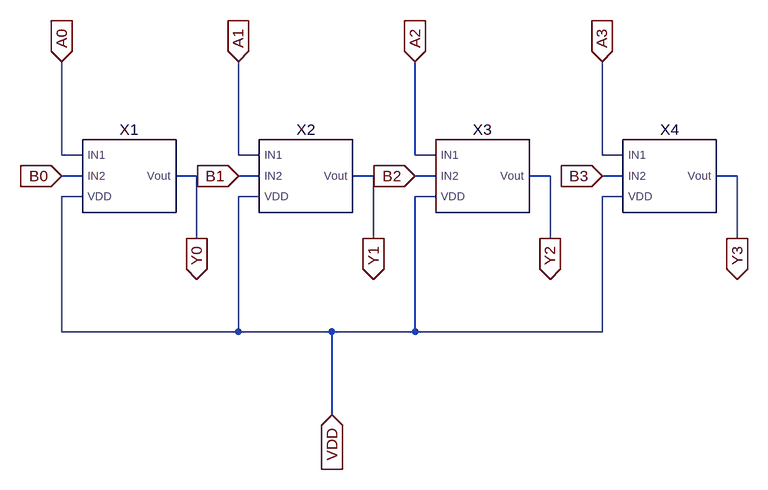
[diagram p0: schematic NOR4.asc]
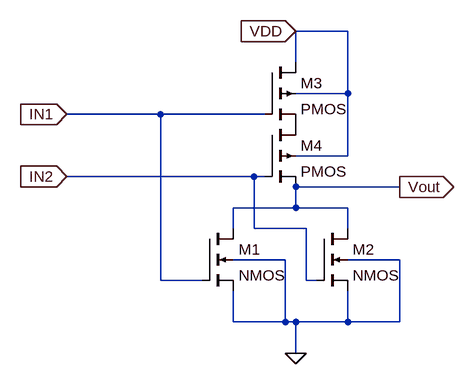
[diagram p1: sub-circuit nor2.asc]
NOR4.asc, the LTspice schematic file:
Version 4.1
SHEET 1 1100 680
WIRE -16 128 -16 -16
WIRE 16 128 -16 128
WIRE 256 128 256 -16
WIRE 288 128 256 128
WIRE 528 128 528 -16
WIRE 560 128 528 128
WIRE 816 128 816 -16
WIRE 848 128 816 128
WIRE 16 160 -16 160
WIRE 192 160 160 160
WIRE 288 160 256 160
WIRE 464 160 432 160
WIRE 560 160 528 160
WIRE 736 160 704 160
WIRE 848 160 816 160
WIRE 1024 160 992 160
WIRE 16 192 -16 192
WIRE 288 192 256 192
WIRE 560 192 528 192
WIRE 848 192 816 192
WIRE 192 256 192 160
WIRE 464 256 464 160
WIRE 736 256 736 160
WIRE 1024 256 1024 160
WIRE -16 400 -16 192
WIRE 256 400 256 192
WIRE 256 400 -16 400
WIRE 400 400 256 400
WIRE 528 400 528 192
WIRE 528 400 400 400
WIRE 816 400 816 192
WIRE 816 400 528 400
WIRE 400 528 400 400
FLAG -16 -16 A0
IOPIN -16 -16 In
FLAG 256 -16 A1
IOPIN 256 -16 In
FLAG 528 -16 A2
IOPIN 528 -16 In
FLAG 816 -16 A3
IOPIN 816 -16 In
FLAG -16 160 B0
IOPIN -16 160 In
FLAG 256 160 B1
IOPIN 256 160 In
FLAG 528 160 B2
IOPIN 528 160 In
FLAG 816 160 B3
IOPIN 816 160 In
FLAG 192 256 Y0
IOPIN 192 256 Out
FLAG 464 256 Y1
IOPIN 464 256 Out
FLAG 736 256 Y2
IOPIN 736 256 Out
FLAG 1024 256 Y3
IOPIN 1024 256 Out
FLAG 400 528 VDD
IOPIN 400 528 In
SYMBOL NOR2 80 160 R0
SYMATTR InstName X1
SYMBOL NOR2 352 160 R0
SYMATTR InstName X2
SYMBOL NOR2 624 160 R0
SYMATTR InstName X3
SYMBOL NOR2 912 160 R0
SYMATTR InstName X4

nor2.asc, the sub-circuit schematic file:
Version 4.1
SHEET 1 880 680
WIRE 352 0 272 0
WIRE 272 48 272 0
WIRE 352 96 352 0
WIRE 352 96 272 96
WIRE 64 128 -80 128
WIRE 224 128 64 128
WIRE 352 192 352 96
WIRE 352 192 272 192
WIRE 208 224 -80 224
WIRE 224 224 208 224
WIRE 432 240 272 240
WIRE 272 272 272 240
WIRE 272 272 176 272
WIRE 352 272 272 272
WIRE 176 304 176 272
WIRE 208 304 208 224
WIRE 288 304 208 304
WIRE 352 304 352 272
WIRE 256 352 176 352
WIRE 432 352 352 352
WIRE 64 384 64 128
WIRE 128 384 64 384
WIRE 288 384 288 304
WIRE 304 384 288 384
WIRE 176 448 176 400
WIRE 256 448 256 352
WIRE 256 448 176 448
WIRE 272 448 256 448
WIRE 352 448 352 400
WIRE 352 448 272 448
WIRE 432 448 432 352
WIRE 432 448 352 448
WIRE 272 496 272 448
FLAG 272 496 0
FLAG 432 240 Vout
IOPIN 432 240 Out
FLAG 272 0 VDD
IOPIN 272 0 In
FLAG -80 128 IN1
IOPIN -80 128 In
FLAG -80 224 IN2
IOPIN -80 224 In
SYMBOL nmos4 128 304 R0
SYMATTR InstName M1
SYMBOL nmos4 304 304 R0
SYMATTR InstName M2
SYMBOL pmos4 224 48 R0
SYMATTR InstName M3
SYMBOL pmos4 224 144 R0
SYMATTR InstName M4

The netlist it stands for:
* NOR4.asc
X§X1 A0 B0 VDD Y0 nor2
X§X2 A1 B1 VDD Y1 nor2
X§X3 A2 B2 VDD Y2 nor2
X§X4 A3 B3 VDD Y3 nor2

* block symbol definitions
.subckt nor2 IN1 IN2 VDD Vout
M1 Vout IN1 0 0 NMOS
M2 Vout IN2 0 0 NMOS
M3 VDD IN1 P001 VDD PMOS
M4 P001 IN2 Vout VDD PMOS
.ends nor2

.model NMOS NMOS
.model PMOS PMOS
.lib standard.mos
.backanno
.end